# Altium schematic sheet Charger_boost_LDO.SchDoc
size A3; SheetNumber: 25; SheetTotal: 35
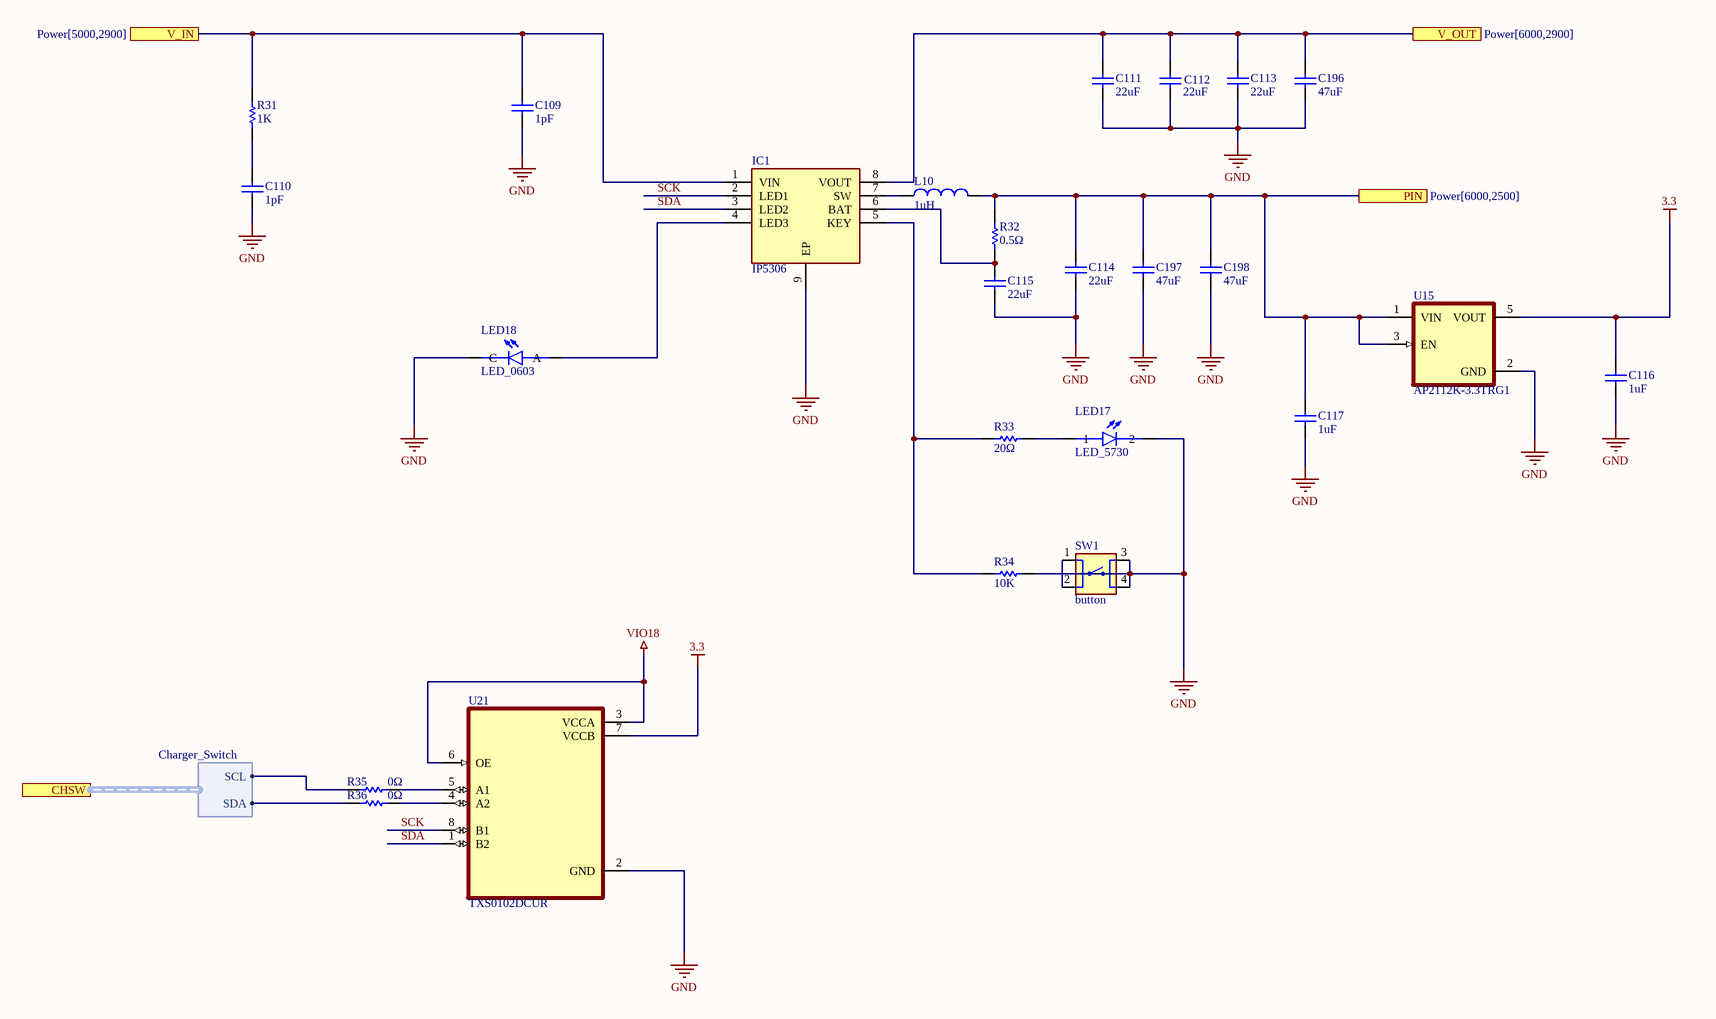
[diagram p0: Charger_boost_LDO.SchDoc]

## Parts
C109  value 1pF  [C0402]  (hidden comment: C0402)
C110  value 1pF  [C0402]  (hidden comment: C0402)
C111  value 22uF  [C1210]  (hidden comment: C1210)
C112  value 22uF  [C1210]  (hidden comment: C1210)
C113  value 22uF  [C1210]  (hidden comment: C1210)
C114  value 22uF  [C1210]  (hidden comment: C1210)
C115  value 22uF  [C1210]  (hidden comment: C1210)
C116  value 1uF  [C0805]  (hidden comment: C0805)
C117  value 1uF  [C0805]  (hidden comment: C0805)
C196  value 47uF  [C1812]  (hidden comment: C1812)
C197  value 47uF  [C1812]  (hidden comment: C1812)
C198  value 47uF  [C1812]  (hidden comment: C1812)
IC1  IP5306  [SOIC127P600X165-9N]
L10  value 1uH  [L0806]  (hidden comment: L0806)
LED17  LED_5730  [SM5730UWDC05]
LED18  LED_0603  [LED_0603]
R31  value 1K  [R0603]  (hidden comment: R0603)
R32  value 0.5Ω  [R1210]  (hidden comment: R1210)
R33  value 20Ω  [R1206]  (hidden comment: R1206)
R34  value 10K  [R0603]  (hidden comment: R0603)
R35  value 0Ω  [R0603]  (hidden comment: R0603)
R36  value 0Ω  [R0603]  (hidden comment: R0603)
SW1  button  [BUTTON]
U15  AP2112K-3.3TRG1  [SOT95P285X140-5N]
U21  TXS0102DCUR  [SOP50P310X90-8N]

## Ports
CHSW (harness Charger_Switch, see Power[5300,2200], I2C_Switch[500,7800], Power[5300,500]), PIN (see Power[6000,2500]), V_IN (see Power[5000,2900]), V_OUT (see Power[6000,2900])

## Harnesses
Charger_Switch: SCL, SDA

## Nets
3.3: C116.2 U15.5(VOUT) U21.7(VCCB)
GND: C109.1 C110.1 C111.1 C112.1 C113.1 C114.1 C115.1 C116.1 C117.1 C196.1 C197.1 C198.1 IC1.9(EP) LED17.2 LED18.C R34.2 SW1.3 SW1.4 U15.2(GND) U21.2(GND)
VIO18: U21.3(VCCA) U21.6(OE)
PIN: C114.2 C117.2 C197.2 C198.2 L10.2 R32.2 U15.1(VIN) U15.3(EN) ; port PIN
SCK: IC1.2(LED1) U21.8(B1)
SDA: IC1.3(LED2) U21.1(B2)
V_IN: C109.2 IC1.1(VIN) R31.2 ; port V_IN
V_OUT: C111.2 C112.2 C113.2 C196.2 IC1.8(VOUT) ; port V_OUT
NetC110_2: C110.2 R31.1
NetC115_2: C115.2 IC1.6(BAT) R32.1
NetIC1_4: IC1.4(LED3) LED18.A
NetIC1_5: IC1.5(KEY) R33.1 R34.1
NetIC1_7: IC1.7(SW) L10.1
NetLED17_1: LED17.1 R33.2
NetR35_1: R35.1 ; port CHSW.SCL
NetR35_2: R35.2 U21.5(A1)
NetR36_1: R36.1 ; port CHSW.SDA
NetR36_2: R36.2 U21.4(A2)
NetSW1_1: SW1.1 SW1.2

## Library data of the parts
IC1 = IP5306: Integrated Circuit; Manufacturer_Name: INJOINIC; Datasheet Link: https://datasheetspdf.com/pdf-file/1139129/Injoinic/IP5306/1; Height: 1.65mm; Manufacturer_Part_Number: IP5306
L10 = L0806: Inductor / SMD:1.6x2mm
LED17 = LED_5730: LED SMD; Manufacturer_Name: Bivar; Datasheet Link: https://ja-bots.com/wp-content/uploads/2023/01/SM5730UWDC05-BIVAR.pdf?srsltid=AfmBOoovMyML2SIj8QvW33aYphKHuiK9c7G9KYdJdHNR0r_sEcANN2ud; Height: 1.154mm; Manufacturer_Part_Number: SM5730UWDC05; Mouser Part Number: 749-SM5730UWDC05; Mouser Price/Stock: https://www.mouser.co.uk/ProductDetail/Bivar/SM5730UWDC05?qs=R6DaRWE8nmu0EcNcbYsDPw%3D%3D; Arrow Part Number: SM5730UWDC05; Arrow Price/Stock: https://www.arrow.com/en/products/sm5730uwdc05/bivar?region=nac
LED18 = LED_0603: LED SMD
SW1 = button: 6x6 mm
U15 = AP2112K-3.3TRG1: Linear Voltage Regulator IC Positive Fixed 1 Output 600mA SOT-25
U21 = TXS0102DCUR: chuyển mức tín hiệu I2C